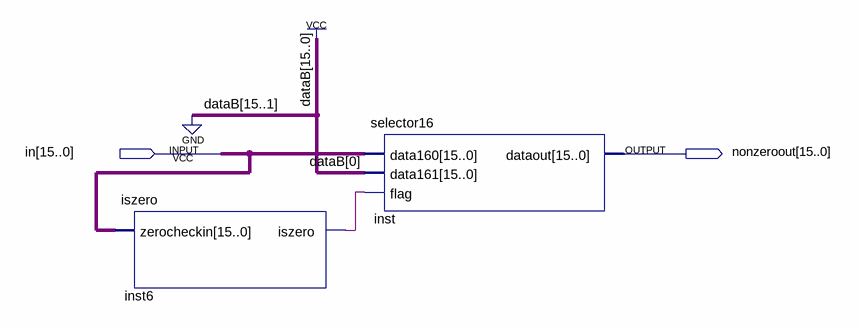
[diagram p0: schematic sheet]
// Quartus schematic avoidzero.bdf as structural Verilog: 2 symbols, 2 pins
module avoidzero (
  input  [15:0] in,
  output [15:0] nonzeroout
);

  wire inst6_iszero;

  iszero inst6 (.zerocheckin(in), .iszero(inst6_iszero));
  selector16 inst (.data160(in), .data161({16{1'b1}}), .flag(inst6_iszero), .dataout(nonzeroout));
endmodule
